# Altium project Charging_PCB.PrjPcb (part 1 of 2)
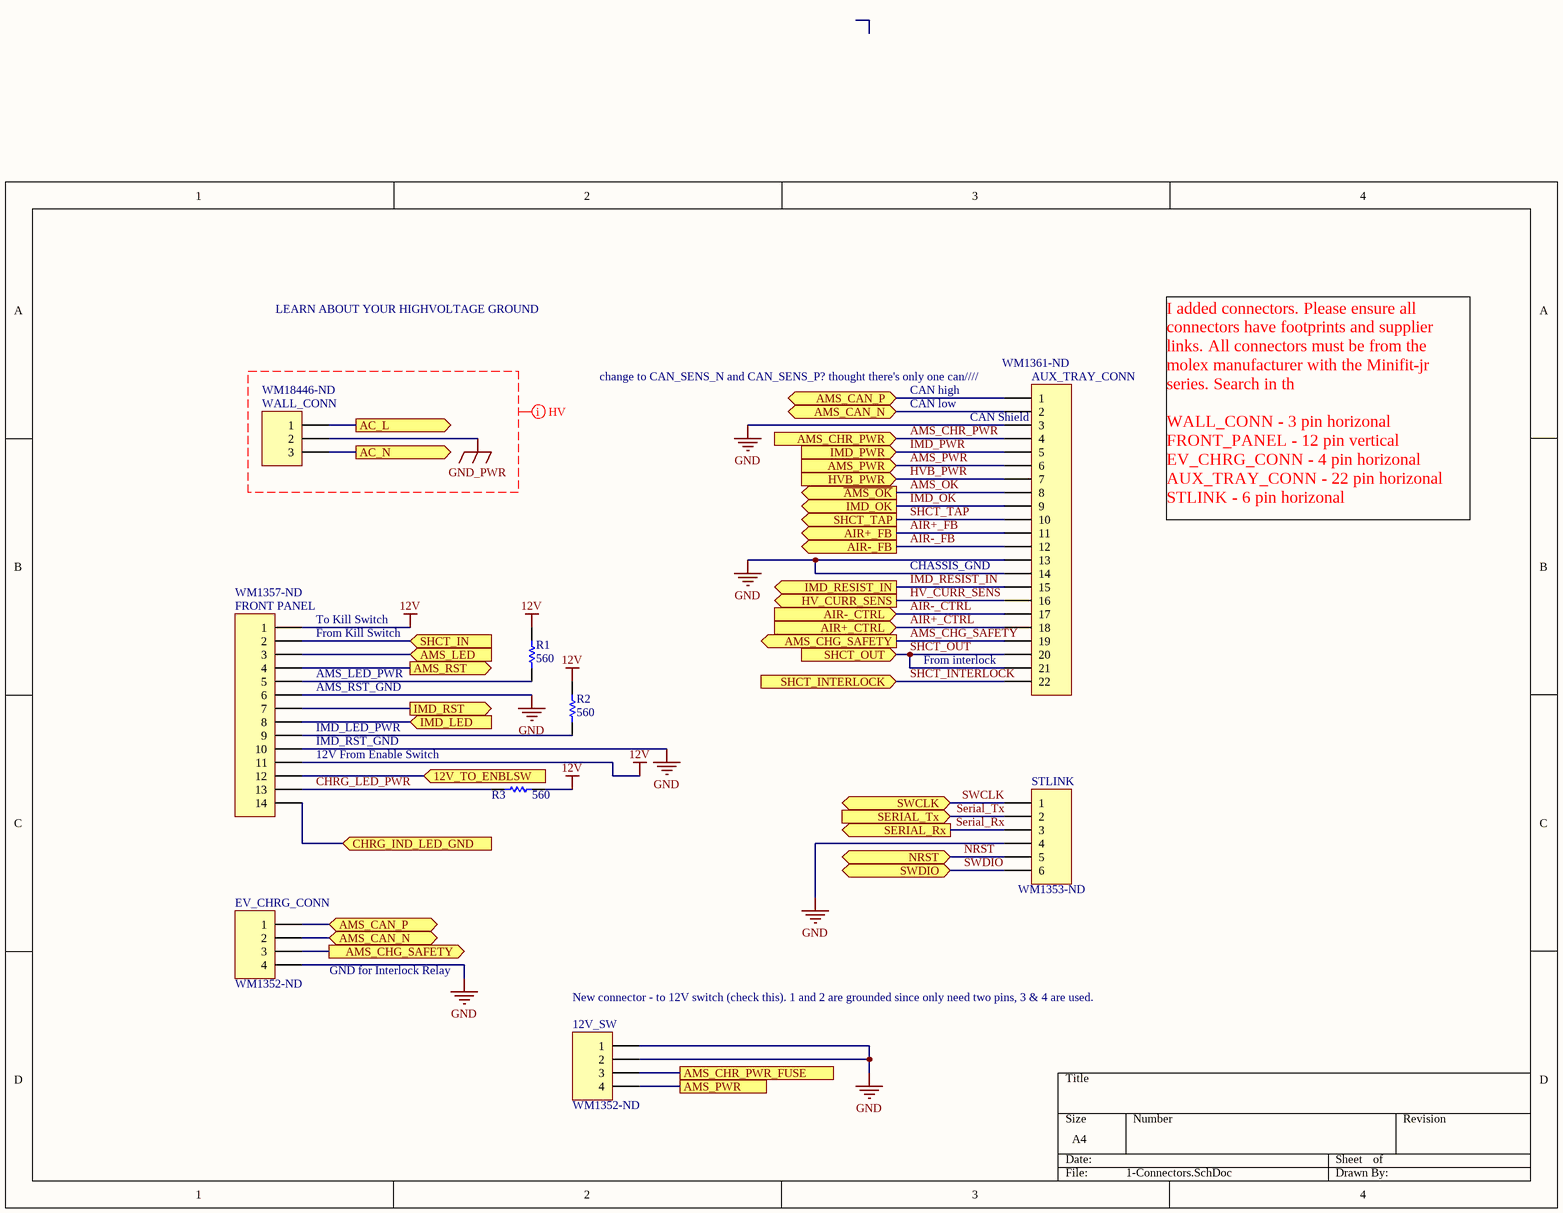
[diagram p0: 1-Connectors.SchDoc]
11 sheets, 147 parts. Net scope: global (net labels, ports and power ports of the same name join across sheets).
Board file: ePBR22_ACC_Charging.PcbDoc
Sheets:
  1-Connectors.SchDoc
  2-FET Control.SchDoc
  3-Fuses.SchDoc
  4-Power.SchDoc
  5-Latching Delay.SchDoc
  6-Latching AMS.SchDoc
  7-Latching IMD.SchDoc
  8-Controller.SchDoc
  9-Protections 1 of 2.SchDoc
  10-Protections 2 of 2.SchDoc
  12-Charging LED Indicator.SchDoc

## Sheet 1-Connectors.SchDoc
size A4

### Parts
12V_SW  Header 4  [WM1352-ND]  (value not drawn)
AUX_TRAY_CONN  (no value)  [WM1361-ND]
EV_CHRG_CONN  Header 4  [WM1352-ND]  (value not drawn)
FRONT_PANEL  (no value)  [WM1357-ND]
R1  560  [RESC0603(1608)_L]
R2  560  [RESC0603(1608)_L]
R3  560  [RESC0603(1608)_L]
STLINK  Header 6  [WM1353-ND]  (value not drawn)
WALL_CONN  Header 3  [WM18446-ND]  (value not drawn)

### Ports
12V_TO_ENBLSW (in), AC_L (out), AC_N (out), AIR+_CTRL (in), AIR+_FB (out), AIR-_CTRL (in), AIR-_FB (out), AMS_CAN_N (bidir), AMS_CAN_P (bidir), AMS_CHG_SAFETY (out), AMS_CHR_PWR (in), AMS_CHR_PWR_FUSE, AMS_LED (in), AMS_PWR, AMS_PWR (in), AMS_RST (out), CHRG_IND_LED_GND (in), HV_CURR_SENS (out), HVB_PWR (in), IMD_LED (in), IMD_OK (out), IMD_PWR (in), IMD_RESIST_IN (out), IMD_RST (out), NRST (bidir), SERIAL_Rx (out), SERIAL_Tx (in), SHCT_IN (in), SHCT_INTERLOCK (in), SHCT_OUT (in), SHCT_TAP (out), SWCLK (bidir), SWDIO (bidir), ~{AMS_OK} (out)

### Nets
12V: FRONT_PANEL.1 FRONT_PANEL.11 R1.2 R2.2 R3.1
GND: 12V_SW.1 12V_SW.2 AUX_TRAY_CONN.3 AUX_TRAY_CONN.13 AUX_TRAY_CONN.14 EV_CHRG_CONN.4 FRONT_PANEL.6 FRONT_PANEL.10 STLINK.4
GND_PWR: WALL_CONN.2
12V_TO_ENBLSW: FRONT_PANEL.12 ; port 12V_TO_ENBLSW
~{AMS_OK}: AUX_TRAY_CONN.8 ; port ~{AMS_OK}
AIR+_CTRL: AUX_TRAY_CONN.18 ; port AIR+_CTRL
AIR+_FB: AUX_TRAY_CONN.11 ; port AIR+_FB
AIR-_CTRL: AUX_TRAY_CONN.17 ; port AIR-_CTRL
AIR-_FB: AUX_TRAY_CONN.12 ; port AIR-_FB
AMS_CHG_SAFETY: AUX_TRAY_CONN.19 EV_CHRG_CONN.3 ; port AMS_CHG_SAFETY
AMS_CHR_PWR: AUX_TRAY_CONN.4 ; port AMS_CHR_PWR
AMS_CHR_PWR_FUSE: 12V_SW.3 ; port AMS_CHR_PWR_FUSE
AMS_LED: FRONT_PANEL.3 ; port AMS_LED
AMS_PWR: 12V_SW.4 AUX_TRAY_CONN.6 ; port AMS_PWR
AMS_RST: FRONT_PANEL.4 ; port AMS_RST
CHRG_LED_PWR: FRONT_PANEL.13 R3.2
HV_CURR_SENS: AUX_TRAY_CONN.16 ; port HV_CURR_SENS
HVB_PWR: AUX_TRAY_CONN.7 ; port HVB_PWR
IMD_LED: FRONT_PANEL.8 ; port IMD_LED
IMD_OK: AUX_TRAY_CONN.9 ; port IMD_OK
IMD_PWR: AUX_TRAY_CONN.5 ; port IMD_PWR
IMD_RESIST_IN: AUX_TRAY_CONN.15 ; port IMD_RESIST_IN
IMD_RST: FRONT_PANEL.7 ; port IMD_RST
NRST: STLINK.5 ; port NRST
Serial_Rx: STLINK.3 ; port SERIAL_Rx
Serial_Tx: STLINK.2 ; port SERIAL_Tx
SHCT_IN: FRONT_PANEL.2 ; port SHCT_IN
SHCT_INTERLOCK: AUX_TRAY_CONN.22 ; port SHCT_INTERLOCK
SHCT_OUT: AUX_TRAY_CONN.20 AUX_TRAY_CONN.21 ; port SHCT_OUT
SHCT_TAP: AUX_TRAY_CONN.10 ; port SHCT_TAP
SWCLK: STLINK.1 ; port SWCLK
SWDIO: STLINK.6 ; port SWDIO
NetAUX_TRAY_CONN_1: AUX_TRAY_CONN.1 EV_CHRG_CONN.1 ; port AMS_CAN_P
NetAUX_TRAY_CONN_2: AUX_TRAY_CONN.2 EV_CHRG_CONN.2 ; port AMS_CAN_N
NetFRONT_PANEL_5: FRONT_PANEL.5 R1.1
NetFRONT_PANEL_9: FRONT_PANEL.9 R2.1
NetFRONT_PANEL_14: FRONT_PANEL.14 ; port CHRG_IND_LED_GND
NetU2_1: WALL_CONN.1 ; port AC_L
NetU2_2: WALL_CONN.3 ; port AC_N

### Layout directives
mark named HV: GND_PWR

### Notes on the sheet
- LEARN ABOUT YOUR HIGHVOLTAGE GROUND
- (near AUX_TRAY_CONN) change to CAN_SENS_N and CAN_SENS_P? thought there's only one can////
- CAN high
- CAN low
- CAN Shield
- I added connectors. Please ensure all connectors have footprints and supplier links. All connectors must be from the molex manufacturer with the Minifit-jr series. Search in th
  WALL_CONN - 3 pin horizonal
  FRONT_PANEL - 12 pin vertical
  EV_CHRG_CONN - 4 pin horizonal
  AUX_TRAY_CONN - 22 pin horizonal
  STLINK - 6 pin horizonal
- (near FRONT_PANEL) To Kill Switch
- CHASSIS_GND
- (near FRONT_PANEL) From Kill Switch
- (near FRONT_PANEL) AMS_LED_PWR
- (near FRONT_PANEL) AMS_RST_GND
- (near AUX_TRAY_CONN) From interlock
- (near FRONT_PANEL) IMD_LED_PWR
- (near FRONT_PANEL) IMD_RST_GND
- 12V From Enable Switch
- GND for Interlock Relay
- (near 12V_SW) New connector - to 12V switch (check this). 1 and 2 are grounded since only need two pins, 3 & 4 are used.

### Library data of the parts
12V_SW EV_CHRG_CONN = Header 4: Header, 4-Pin; LatestRevisionDate: 17-Jul-2002; LatestRevisionNote: Re-released for DXP Platform.; Publisher: Altium Limited; Supplier 1: Digi-Key; Supplier Part Number 1: WM1352-ND
AUX_TRAY_CONN = Header 22: Header, 22-Pin; LatestRevisionDate: 17-Jul-2002; LatestRevisionNote: Re-released for DXP Platform.; Publisher: Altium Limited; Supplier 1: Digi-Key; Supplier Part Number 1: WM1361-ND
FRONT_PANEL = Header 14: Header, 14-Pin; LatestRevisionDate: 17-Jul-2002; LatestRevisionNote: Re-released for DXP Platform.; Publisher: Altium Limited; Supplier 1: Digi-Key; Supplier Part Number 1: WM1357-ND
R1-R3 = CMP-1591-00001-1: 0603 (1608 Metric) Chip Resistor; Case-Metric: 1608; Case-EIA: 0603; PackageReference: RESC0603(1608); Supplier 1: Digi-Key; Supplier Part Number 1: P560BZCT-ND
STLINK = Header 6: Header, 6-Pin; LatestRevisionDate: 17-Jul-2002; LatestRevisionNote: Re-released for DXP Platform.; Publisher: Altium Limited; Supplier 1: Digi-Key; Supplier Part Number 1: WM1353-ND
WALL_CONN = Header 3: Header, 3-Pin; LatestRevisionDate: 17-Jul-2002; LatestRevisionNote: Re-released for DXP Platform.; Publisher: Altium Limited; Supplier 1: Digi-Key; Supplier Part Number 1: WM18446-ND

## Sheet 2-FET Control.SchDoc
size A
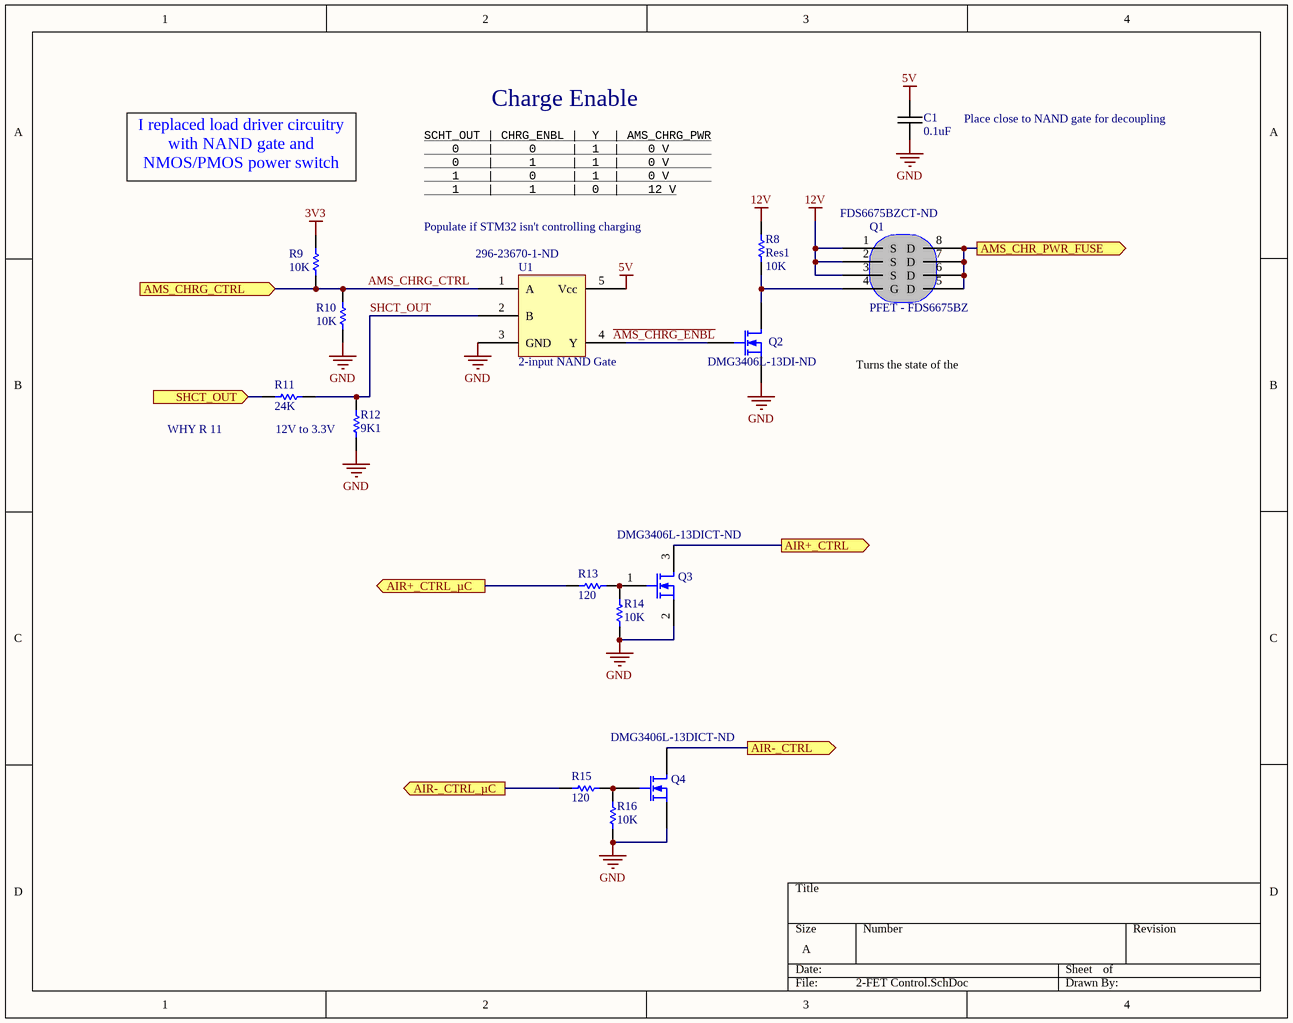
[diagram p1: 2-FET Control.SchDoc]

### Parts
C1  value 0.1uF  [1608[0603]]  (hidden comment: 100nF)
Q1  PFET - FDS6675BZ  Supplier Part Number 1: FDS6675BZCT-ND  [SOIC127P600X175-8N]
Q2  Supplier Part Number 1: DMG3406L-13DI-ND  [SOT-23_N]
Q3  Supplier Part Number 1: DMG3406L-13DICT-ND  [SOT-23_N]
Q4  Supplier Part Number 1: DMG3406L-13DICT-ND  [SOT-23_N]
R8  Res1  value 10K  [1608[0603]]
R9  10K  [RESC0603(1608)_L]
R10  10K  [RESC0603(1608)_L]
R11  24K  [RESC0603(1608)_N]
R12  9K1  [RESC0603(1608)_M]
R13  120  [1608[0603]]
R14  10K  [1608[0603]]
R15  120  [1608[0603]]
R16  10K  [1608[0603]]
U1  2-input NAND Gate  Supplier Part Number 1: 296-23670-1-ND  [SOT23-6_M]

### Ports
AIR+_CTRL (out), AIR+_CTRL_µC (out), AIR-_CTRL (out), AIR-_CTRL_µC (out), AMS_CHR_PWR_FUSE (out), AMS_CHRG_CTRL (in), SHCT_OUT (in)

### Nets
3V3: R9.2
5V: C1.1 U1.5(Vcc)
12V: Q1.1(S) Q1.2(S) Q1.3(S) R8.2
GND: C1.2 Q2.2(S) Q3.2(S) Q4.2(S) R10.1 R12.1 R14.1 R16.1 U1.3(GND)
AIR+_CTRL: Q3.3(D) ; port AIR+_CTRL
AIR-_CTRL: Q4.3(D) ; port AIR-_CTRL
AMS_CHR_PWR_FUSE: Q1.5(D) Q1.6(D) Q1.7(D) Q1.8(D) ; port AMS_CHR_PWR_FUSE
AMS_CHRG_CTRL: R9.1 R10.2 U1.1(A) ; port AMS_CHRG_CTRL
SHCT_OUT: R11.1 R11.2 R12.2 U1.2(B) ; port SHCT_OUT
NetQ1_4: Q1.4(G) Q2.3(D) R8.1
NetQ2_1: Q2.1(G) U1.4(Y)
NetQ3_1: Q3.1(G) R13.2 R14.2
NetQ4_1: Q4.1(G) R15.2 R16.2
NetR13_1: R13.1 ; port AIR+_CTRL_µC
NetR15_1: R15.1 ; port AIR-_CTRL_µC

### Notes on the sheet
- Charge Enable
- Place close to NAND gate for decoupling
- I replaced load driver circuitry with NAND gate and NMOS/PMOS power switch
- (near R8) SCHT_OUT | CHRG_ENBL |  Y  | AMS_CHRG_PWR
  0    |     0     |  1  |    0 V
  0    |     1     |  1  |    0 V
  1    |     0     |  1  |    0 V
  1    |     1     |  0  |    12 V
- Populate if STM32 isn't controlling charging
- WHY R 11
- (near R12) 12V to 3.3V
- Turns the state of the
- Labels drawn without touching a wire or pin: ~{AMS_CHRG_ENBL}

### Library data of the parts
C1 = 0805C-100nF-25V-X7R-MUR: CAP CER 0.1UF 50V X7R 0603; Manufacturer: Kemet; Manufacturer Part Number: C0603C104K5RACAUTO; Capacitance: 0.1µF; Tolerance: ±10%; Supplier 1: Digi-Key; Supplier Part Number 1: 399-6856-1-ND; RoHS: RoHS Compliant; Category: Capacitors; Stock 1: 157876; Pricing 1: 1=0.14, 10=0.095, 25=0.0672, 50=0.0514, 100=0.0435, 250=0.03556, 1000=0.02324 (CAD); Packaging: Cut Tape (CT); Voltage - Rated: 50V; Temperature Coefficient: X7R; Mounting Type: Surface Mount, MLCC; Operating Temperature: -55°C ~ 125°C; Applications: Automotive; Ratings: AEC-Q200; Package / Case: 0603 (1608 Metric); Size / Dimension: 0.063" L x 0.031" W (1.60mm x 0.80mm); Height - Seated (Max): -; Thickness (Max): 0.034" (0.87mm); Lead Spacing: -; Features: -; Lead Style: -; ComponentLink1URL: http://capacitoredge.kemet.com/capedge2/DataSheet?pn=C0603C104K5RACAUTO; ComponentLink1Description: http://capacitoredge.kemet.com/capedge2/DataSheet?pn=C0603C104K5RACAUTO
Q1 = MOSFET: MOSFET P-CH 8-SOIC; Manufacturer: Fairchild/ON Semiconductor; FET Type: P-Channel; Drain to Source Voltage (Vdss): 30V; Current - Continuous Drain (Id) @ 25°C: 11A (Ta); Drive Voltage (Max Rds On,  Min Rds On): 4.5V, 10V; Vgs(th) (Max) @ Id: 3V @ 250µA; Gate Charge (Qg) (Max) @ Vgs: 62nC @ 10V; Input Capacitance (Ciss) (Max) @ Vds: 2470pF @ 15V; Vgs (Max): ±25V; Power Dissipation (Max): 2.5W (Ta); Rds On (Max) @ Id, Vgs: 13 mOhm @ 11A, 10V; Manufacturer Part Number: FDS6675BZ; RoHS: RoHS Compliant; Category: Discrete Semiconductor Products; Stock 1: 7940; Pricing 1: 1=1.29, 10=1.156, 100=0.9013, 500=0.74452, 1000=0.58778 (CAD); Packaging: Cut Tape (CT); Part Status: Active; Technology: MOSFET (Metal Oxide); FET Feature: -; Operating Temperature: -55°C ~ 150°C (TJ); Mounting Type: Surface Mount; Supplier Device Package: 8-SO; Package / Case: 8-SOIC (0.154", 3.90mm Width); ComponentLink1URL: https://www.fairchildsemi.com/datasheets/FD/FDS6675BZ.pdf; ComponentLink1Description: https://www.fairchildsemi.com/datasheets/FD/FDS6675BZ.pdf; Supplier 1: Digi-Key
Q2-Q4 = MOSFET-N: N-Channel MOSFET; Manufacturer: Infineon Technologies; Manufacturer Part Number: IPD075N03L G; FET Type: MOSFET N-Channel, Metal Oxide; FET Feature: Logic Level Gate; Drain to Source Voltage (Vdss): 30V; Current - Continuous Drain (Id) @ 25°C: 50A (Tc); Rds On (Max) @ Id, Vgs: 7.5 mOhm @ 30A, 10V; Vgs(th) (Max) @ Id: 2.2V @ 250µA; Gate Charge (Qg) @ Vgs: 18nC @ 10V; Input Capacitance (Ciss) @ Vds: 1900pF @ 15V; Power - Max: 47W; Published: 8-Jun-2000; LatestRevisionDate: 17-Jul-2002; LatestRevisionNote: Re-released for DXP Platform.; PackageVersion: 1995/1996; PackageReference: E3; Publisher: Altium Limited; PackageDescription: TO, Flat Index; 3 In-Line, Axial Leads; Body Dia. 4.6mm; Lead Dia. 0.5 mm (max); RoHS: RoHS Compliant; Category: Discrete Semiconductor Products; Packaging: Cut Tape (CT); Mounting Type: Surface Mount; Package / Case: TO-252-3, DPak (2 Leads + Tab), SC-63; Supplier Device Package: PG-TO252-3; ComponentLink1URL: http://www.infineon.com/dgdl/Infineon-IPD075N03LG-DS-v02_01-en.pdf?folderId=5546d4694909da4801490a07012f053b&fileId=db3a30431936bc4b011951d824f83aeb; ComponentLink1Description: http://www.infineon.com/dgdl/Infineon-IPD075N03LG-DS-v02_01-en.pdf?folderId=5546d4694909da4801490a07012f053b&fileId=db3a30431936bc4b011951d824f83aeb; ComponentLink2URL: http://www.semicon.toshiba.co.jp/info/docget.jsp?type=datasheet&lang=en&pid=SSM3K329R; ComponentLink2Description: http://www.semicon.toshiba.co.jp/info/docget.jsp?type=datasheet&lang=en&pid=SSM3K329R; Supplier 1: Digi-Key
R8 = Res1: RES SMD 10K OHM 5% 1/4W 0603; Manufacturer: Rohm Semiconductor; Manufacturer Part Number: ESR03EZPJ103; Power (Watts): 0.25W, 1/4W; Temperature Coefficient: ±200ppm/°C; Published: 8-Jun-2000; LatestRevisionDate: 17-Jul-2002; LatestRevisionNote: Re-released for DXP Platform.; PackageReference: AXIAL-0.3; Publisher: Altium Limited; PackageDescription: Axial Device, Thru-Hole; 2 Leads; 0.3 in Pin Spacing; Supplier 1: Digi-Key; Supplier Part Number 1: RHM10KDCT-ND; RoHS: RoHS Compliant; Category: Resistors; Stock 1: 0; Pricing 1: 1=0.15, 10=0.119, 25=0.0824, 50=0.0642, 100=0.0458, 250=0.03568, 500=0.02836, 1000=0.02012 (CAD); Packaging: Cut Tape (CT); Part Status: Active; Resistance (Ohms): 10k; Tolerance: ±5%; Composition: Thick Film; Features: Automotive AEC-Q200, Pulse Withstanding; Operating Temperature: -55°C ~ 155°C; Package / Case: 0603 (1608 Metric); Supplier Device Package: 0603; Size / Dimension: 0.063" L x 0.031" W (1.60mm x 0.80mm); Height - Seated (Max): 0.022" (0.55mm); Failure Rate: -; ComponentLink1URL: http://rohmfs.rohm.com/en/products/databook/datasheet/passive/resistor/chip_resistor/esr.pdf; ComponentLink1Description: http://rohmfs.rohm.com/en/products/databook/datasheet/passive/resistor/chip_resistor/esr.pdf
R9 R10 = CMP-1591-00001-1: as R1 on sheet 1-Connectors; PackageReference: RESC0603(1608); Supplier 1: Digi-Key; Supplier Part Number 1: 311-10KGRCT-ND
R11 = CMP-1012-00107-1: 24K 0.1W 5% 0603 (1608 Metric)  SMD; Case-Metric: 1608; Case-EIA: 0603; Value: 24000.00 Ohm; Tolerance: 5 %; Technology: SMT; Power: 0.1 W
R12 = CMP-1012-00097-1: 9K1 0.1W 5% 0603 (1608 Metric)  SMD; Case-EIA: 0603; Value: 9100.00 Ohm; Case-Metric: 1608; Technology: SMT; Power: 0.1 W; Tolerance: 5 %
R13 R15 = Res1: Resistor; Manufacturer: Panasonic Electronic Components; Manufacturer Part Number: ERJ-3EKF60R4V; Resistance (Ohms): 60.4; Tolerance: ±1%; Power (Watts): 0.1W, 1/10W; Temperature Coefficient: ±100ppm/°C; Published: 8-Jun-2000; LatestRevisionDate: 17-Jul-2002; LatestRevisionNote: Re-released for DXP Platform.; PackageReference: AXIAL-0.3; Publisher: Altium Limited; PackageDescription: Axial Device, Thru-Hole; 2 Leads; 0.3 in Pin Spacing; Value: 120; Supplier 1: Digi-Key; Supplier Part Number 1: P60.4HCT-ND; RoHS: RoHS Compliant; Category: Resistors; Stock 1: 113077; Pricing 1: 1=0.15, 50=0.0176, 100=0.0129, 250=0.00992, 500=0.0079, 1000=0.00583 (CAD); Packaging: Cut Tape (CT); Composition: Thick Film; Features: Automotive AEC-Q200; Operating Temperature: -55°C ~ 155°C; Package / Case: 0603 (1608 Metric); Supplier Device Package: 0603; Size / Dimension: 0.063" L x 0.031" W (1.60mm x 0.80mm); Height: 0.022" (0.55mm); Number of Terminations: 2; ComponentLink1URL: http://industrial.panasonic.com/www-cgi/jvcr13pz.cgi?E+PZ+3+AOA0002+ERJ3EKF60R4V+7+WW; ComponentLink1Description: http://industrial.panasonic.com/www-cgi/jvcr13pz.cgi?E+PZ+3+AOA0002+ERJ3EKF60R4V+7+WW
R14 R16 = Res1: Resistor; Manufacturer: Rohm Semiconductor; Manufacturer Part Number: ESR03EZPJ103; Tolerance: ±5%; Power (Watts): 0.25W, 1/4W; Temperature Coefficient: ±200ppm/°C; Published: 8-Jun-2000; LatestRevisionDate: 17-Jul-2002; LatestRevisionNote: Re-released for DXP Platform.; PackageReference: AXIAL-0.3; Publisher: Altium Limited; PackageDescription: Axial Device, Thru-Hole; 2 Leads; 0.3 in Pin Spacing; Value: 10K; Supplier 1: Digi-Key; Supplier Part Number 1: RHM10KDCT-ND; RoHS: RoHS Compliant; Category: Resistors; Stock 1: 8360; Pricing 1: 1=0.15, 10=0.121, 25=0.0836, 100=0.0466, 250=0.03628, 500=0.02884, 1000=0.02046 (CAD); Packaging: Cut Tape (CT); Resistance (Ohms): 10k; Composition: Thick Film; Features: Automotive AEC-Q200, Pulse Withstanding; Operating Temperature: -55°C ~ 155°C; Package / Case: 0603 (1608 Metric); Supplier Device Package: 0603 (1608 Metric); Size / Dimension: 0.063" L x 0.031" W (1.60mm x 0.80mm); Height: 0.022" (0.55mm); Number of Terminations: 2; ComponentLink1URL: http://rohmfs.rohm.com/en/products/databook/datasheet/passive/resistor/chip_resistor/esr.pdf; ComponentLink1Description: http://rohmfs.rohm.com/en/products/databook/datasheet/passive/resistor/chip_resistor/esr.pdf
U1 = NC7SZ08: IC GATE NAND 1CH 2-INP SC-70-5; Manufacturer: Texas Instruments; Manufacturer Part Number: SN74AHC1G00QDCKRQ1; Number of Circuits: 1; Number of Inputs: 2; Voltage - Supply: 2 V ~ 5.5 V; Current - Quiescent (Max): 1µA; Current - Output High, Low: 8mA, 8mA; Logic Level - Low: 0.5 V ~ 1.65 V; Logic Level - High: 1.5 V ~ 3.85 V; Max Propagation Delay @ V, Max CL: 7.5ns @ 5V, 50pF; RoHS: RoHS Compliant; Category: Integrated Circuits (ICs); Stock 1: 7211; Pricing 1: 1=0.69, 10=0.524, 100=0.3262, 500=0.22294, 1000=0.17137 (CAD); Packaging: Cut Tape (CT); Logic Type: NAND Gate; Features: Schmitt Trigger; Operating Temperature: -40°C ~ 125°C; Mounting Type: Surface Mount; Supplier Device Package: SC-70-5; Package / Case: 5-TSSOP, SC-70-5, SOT-353; ComponentLink1URL: http://www.ti.com/lit/ds/symlink/sn74ahc1g00-q1.pdf; ComponentLink1Description: http://www.ti.com/lit/ds/symlink/sn74ahc1g00-q1.pdf; Supplier 1: Digi-Key

## Sheet 3-Fuses.SchDoc
size A4
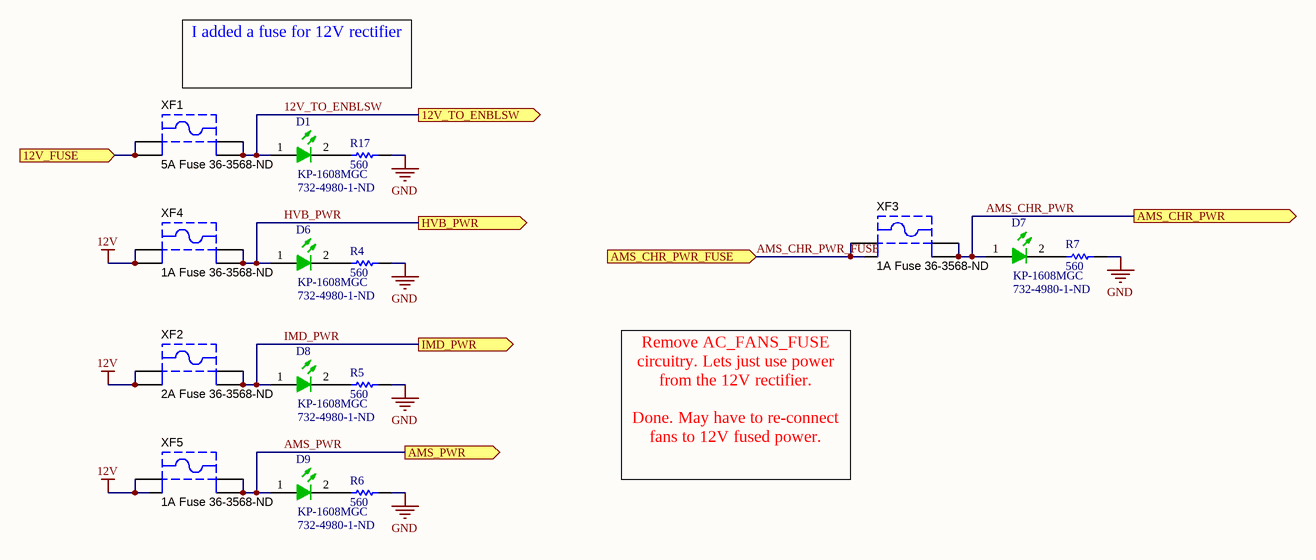
[diagram p2: 3-Fuses.SchDoc]

### Parts
D1  KP-1608MGC  Supplier Part Number 1: 732-4980-1-ND  [KING-0603LED_GREEN_V]
D6  KP-1608MGC  Supplier Part Number 1: 732-4980-1-ND  [KING-0603LED_GREEN_V]
D7  KP-1608MGC  Supplier Part Number 1: 732-4980-1-ND  [KING-0603LED_GREEN_V]
D8  KP-1608MGC  Supplier Part Number 1: 732-4980-1-ND  [KING-0603LED_GREEN_V]
D9  KP-1608MGC  Supplier Part Number 1: 732-4980-1-ND  [KING-0603LED_GREEN_V]
R4  560  [RESC0603(1608)_L]
R5  560  [RESC0603(1608)_L]
R6  560  [RESC0603(1608)_L]
R7  560  [RESC0603(1608)_L]
R17  560  [RESC0603(1608)_L]
XF1  5A Fuse 36-3568-ND  [KSTN-3568_V]
XF2  2A Fuse 36-3568-ND  [KSTN-3568_V]
XF3  1A Fuse 36-3568-ND  [KSTN-3568_V]
XF4  1A Fuse 36-3568-ND  [KSTN-3568_V]
XF5  1A Fuse 36-3568-ND  [KSTN-3568_V]

### Ports
12V_FUSE (in), 12V_TO_ENBLSW (out), AMS_CHR_PWR (out), AMS_CHR_PWR_FUSE (in), AMS_PWR (out), HVB_PWR (out), IMD_PWR (out)

### Nets
12V: XF2.1 XF2.2 XF4.1 XF4.2 XF5.1 XF5.2
GND: R4.2 R5.2 R6.2 R7.2 R17.2
12V_TO_ENBLSW: D1.1(A) XF1.3 XF1.4 ; port 12V_TO_ENBLSW
AMS_CHR_PWR: D7.1(A) XF3.3 XF3.4 ; port AMS_CHR_PWR
AMS_CHR_PWR_FUSE: XF3.1 XF3.2 ; port AMS_CHR_PWR_FUSE
AMS_PWR: D9.1(A) XF5.3 XF5.4 ; port AMS_PWR
HVB_PWR: D6.1(A) XF4.3 XF4.4 ; port HVB_PWR
IMD_PWR: D8.1(A) XF2.3 XF2.4 ; port IMD_PWR
NetD1_2: D1.2(K) R17.1
NetD6_2: D6.2(K) R4.1
NetD7_2: D7.2(K) R7.1
NetD8_2: D8.2(K) R5.1
NetD9_2: D9.2(K) R6.1
NetU2_4: XF1.1 XF1.2 ; port 12V_FUSE

### Notes on the sheet
- I added a fuse for 12V rectifier
- Remove AC_FANS_FUSE circuitry. Lets just use power from the 12V rectifier.
  Done. May have to re-connect fans to 12V fused power.

### Library data of the parts
D1 D6-D9 = CMP-0404-00001-1: LED, SMT, 0603(1608), 1.1mm thickness, Green; Manufacturer: Kingbright; Reverse Voltage: 5 V; Power Dissipation: 75 mW; Forward Current: 30 mA; Packing Type: 2000 pcs / reel; Mounting Technology: Surface Mount; Storage Temperature: -40 to +85 degC; ComponentLink1URL: http://www.kingbright.com/; PackageDescription: 2-Pin SMT LED, 1.6 x 0.8 mm Pitch; PartNumber: KP-1608MGC; PackageReference: 0603LED_GREEN; ComponentLink1Description: Manufacturer URL; Supplier 1: Digi-Key
R4-R7 R17 = CMP-1591-00001-1: as R1 on sheet 1-Connectors; PackageReference: RESC0603(1608); Supplier 1: Digi-Key; Supplier Part Number 1: P560BZCT-ND
XF1-XF5 = CMP-2000-05464-1: Fuse Holder, 20 A, 500 V, -50 to 145 degC, 4-Pin THD, RoHS; Manufacturer: Keystone; Package Reference: 3568; Datasheet Version: 04/2013; Datasheet URL: https://datasheet.ciiva.com/16294/m60-2p40-16294706.pdf; Manufacturer URL: http://www.keyelco.com/; Mounting Technology: ThroughHole; Package Description: 4-Pin Through Hole Device, Body 16 x 6.73 mm, Pitch 9.9 mm

## Sheet 4-Power.SchDoc
size A
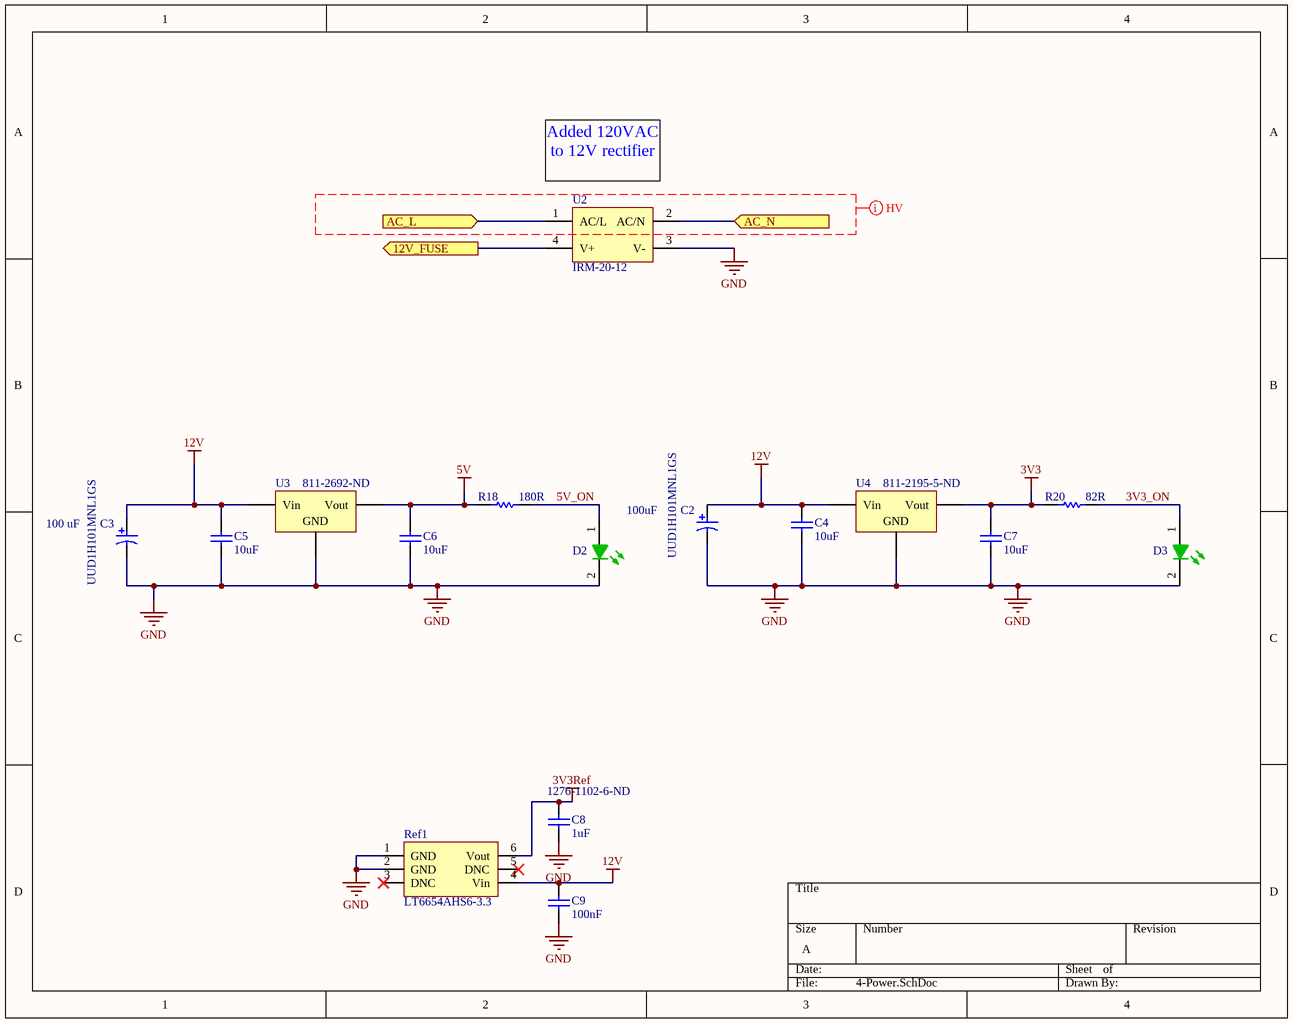
[diagram p3: 4-Power.SchDoc]

### Parts
C2  UUD1H101MNL1GS  [NIC-CAPA2-8X10_V]
C3  UUD1H101MNL1GS  Rated Capacitance: 100 uF  [NIC-CAPA2-8X10_V]
C4  value 10uF  [C1210_M]  (hidden comment: Cap)
C5  value 10uF  [C1210_M]  (hidden comment: Cap)
C6  value 10uF  [C1210_M]  (hidden comment: Cap)
C7  value 10uF  [C1210_M]  (hidden comment: Cap)
C8  value 1uF  Supplier Part Number 1: 1276-1102-6-ND  [1608[0603]]  (hidden comment: Cap)
C9  value 100nF  [1608[0603]]  (hidden comment: Cap)
D2  KP-1608MGC  [KING-0603LED_GREEN_V]  (value not drawn)
D3  KP-1608MGC  [KING-0603LED_GREEN_V]  (value not drawn)
R18  value 180R  [1608[0603]]  (hidden comment: Res1)
R20  value 82R  [1608[0603]]  (hidden comment: Res1)
Ref1  LT6654AHS6-3.3  [TSOT-23]
U2  IRM-20-12  [MEANW-IRM-20-12]
U3  Supplier Part Number 1: 811-2692-ND  [DCDC_HORIZONTAL]  (hidden comment: Volt Reg)
U4  Supplier Part Number 1: 811-2195-5-ND  [DCDC_VERTICAL]  (hidden comment: Volt Reg)

### Ports
12V_FUSE (out), AC_L (in), AC_N (in)

### Nets
3V3: C7.2 R20.1 U4.3(Vout)
3V3Ref: C8.2 Ref1.6(Vout)
5V: C6.2 R18.1 U3.3(Vout)
12V: C2.1 C3.1 C4.2 C5.2 C9.2 Ref1.4(Vin) U3.1(Vin) U4.1(Vin)
GND: C2.2 C3.2 C4.1 C5.1 C6.1 C7.1 C8.1 C9.1 D2.2(K) D3.2(K) Ref1.1(GND) Ref1.2(GND) U2.3(V-) U3.2(GND) U4.2(GND)
3V3_ON: D3.1(A) R20.2
5V_ON: D2.1(A) R18.2
NetU2_1: U2.1(AC/L) ; port AC_L
NetU2_2: U2.2(AC/N) ; port AC_N
NetU2_4: U2.4(V+) ; port 12V_FUSE

Not connected (* = marked no-connect by the designer): Ref1 3(DNC)* 5(DNC)*

### Layout directives
mark named HV: (no net found under the mark)

### Notes on the sheet
- (near U2) Added 120VAC to 12V rectifier
- 100uF

### Library data of the parts
C2 = CMP-0687-00073-1: Aluminum Electrolytic Capacitor, UD Series, Low Impedance, 100 uF, 50 V, + / - 20%, -55 to 105 degC, Chip Type, 8 x 10 mm D x L, Pb-Free, Reel; Manufacturer: Nichicon; Rated Ripple Current (at 100kHz): 300 mA; Tolerance Rated Capacitance: -20 to 20%; Packing: Dia382mm Reel; Impedance: 0.34 Ohm; Rated Voltage: 50 V; Endurance Time: 5000 h; Rated Capacitance: 100 uF; Capacitance: 100µF; Voltage Rating: 50V; Lifetime @ Temp.: 5000 Hrs @ 105°C; Polarization: Polar; Ripple Current: 300mA; Surface Mount Land Size: 0.327" L x 0.327" W (8.30mm x 8.30mm); ComponentLink3Description: Package Specification; ComponentLink2Description: Datasheet; PackageReference: CAPAE-D8H10; RoHS: TRUE; Length: 10 mm; Mounting Technology: Surface Mount; PackageDescription: 2-Pin Surface Mount Device, Diameter 8 mm, Height 10 mm, Pitch 6.5 mm; DatasheetVersion: 08/2012; Diameter: 8 mm; ComponentLink3URL: http://products.nichicon.co.jp/en/pdf/XJA043/e-ud.pdf; ComponentLink1Description: Manufacturer URL; PartNumber: UUD1H101MNL1GS; ComponentLink2URL: http://products.nichicon.co.jp/en/pdf/XJA043/e-ud.pdf; ComponentLink1URL: http://www.nichicon.co.jp/; Supplier 1: Digi-Key; Supplier Part Number 1: 493-2306-1-ND; Manufacturer Part Number: UUD1H101MNL1GS; Category: Capacitors; Stock 1: 65948; Pricing 1: 1=0.92, 10=0.685, 25=0.5868, 50=0.5478, 100=0.4696, 250=0.43044 (CAD); Packaging: Cut Tape (CT); Part Status: Active; Tolerance: ±20%; ESR (Equivalent Series Resistance): -; Operating Temperature: -55°C ~ 105°C; Applications: General Purpose; Lead Spacing: -; Size / Dimension: 0.315" Dia (8.00mm); Height - Seated (Max): 0.394" (10.00mm); Mounting Type: Surface Mount; Package / Case: Radial, Can - SMD; ComponentLink4URL: http://nichicon-us.com/english/products/pdfs/e-uud.pdf; ComponentLink4Description: http://nichicon-us.com/english/products/pdfs/e-uud.pdf
C3 = CMP-0687-00073-1: Aluminum Electrolytic Capacitor, UD Series, Low Impedance, 100 uF, 50 V, + / - 20%, -55 to 105 degC, Chip Type, 8 x 10 mm D x L, Pb-Free, Reel; Manufacturer: Nichicon; Rated Ripple Current (at 100kHz): 300 mA; Tolerance Rated Capacitance: -20 to 20%; Packing: Dia382mm Reel; Impedance: 0.34 Ohm; Rated Voltage: 50 V; Endurance Time: 5000 h; Capacitance: 100µF; Voltage Rating: 50V; Lifetime @ Temp.: 5000 Hrs @ 105°C; Polarization: Polar; Ripple Current: 300mA; Surface Mount Land Size: 0.327" L x 0.327" W (8.30mm x 8.30mm); ComponentLink3Description: Package Specification; ComponentLink2Description: Datasheet; PackageReference: CAPAE-D8H10; RoHS: TRUE; Length: 10 mm; Mounting Technology: Surface Mount; PackageDescription: 2-Pin Surface Mount Device, Diameter 8 mm, Height 10 mm, Pitch 6.5 mm; DatasheetVersion: 08/2012; Diameter: 8 mm; ComponentLink3URL: http://products.nichicon.co.jp/en/pdf/XJA043/e-ud.pdf; ComponentLink1Description: Manufacturer URL; PartNumber: UUD1H101MNL1GS; ComponentLink2URL: http://products.nichicon.co.jp/en/pdf/XJA043/e-ud.pdf; ComponentLink1URL: http://www.nichicon.co.jp/; Supplier 1: Digi-Key; Supplier Part Number 1: 493-2306-1-ND; Manufacturer Part Number: UUD1H101MNL1GS; Category: Capacitors; Stock 1: 65948; Pricing 1: 1=0.92, 10=0.685, 25=0.5868, 50=0.5478, 100=0.4696, 250=0.43044 (CAD); Packaging: Cut Tape (CT); Part Status: Active; Tolerance: ±20%; ESR (Equivalent Series Resistance): -; Operating Temperature: -55°C ~ 105°C; Applications: General Purpose; Lead Spacing: -; Size / Dimension: 0.315" Dia (8.00mm); Height - Seated (Max): 0.394" (10.00mm); Mounting Type: Surface Mount; Package / Case: Radial, Can - SMD; ComponentLink4URL: http://nichicon-us.com/english/products/pdfs/e-uud.pdf; ComponentLink4Description: http://nichicon-us.com/english/products/pdfs/e-uud.pdf
C4-C7 = Cap: Capacitor; Manufacturer: Yageo; Manufacturer Part Number: CC1210ZKY5V8BB106; Capacitance: 10µF; Tolerance: -20%, +80%; Voltage - Rated: 25V; Temperature Coefficient: Y5V (F); Supplier 1: Digi-Key; Supplier Part Number 1: 311-2063-1-ND; RoHS: RoHS Compliant; Category: Capacitors; Stock 1: 1156; Pricing 1: 1=0.47, 10=0.323, 25=0.258, 50=0.2154, 100=0.1829, 250=0.14528, 500=0.12912, 1000=0.11298 (CAD); Packaging: Cut Tape (CT); Part Status: Active; Operating Temperature: -30°C ~ 85°C; Features: -; Ratings: -; Applications: General Purpose; Failure Rate: -; Mounting Type: Surface Mount, MLCC; Package / Case: 1210 (3225 Metric); Size / Dimension: 0.126" L x 0.098" W (3.20mm x 2.50mm); Height - Seated (Max): -; Thickness (Max): 0.083" (2.10mm); Lead Spacing: -; Lead Style: -; ComponentLink1URL: http://www.yageo.com/documents/recent/UPY-GPHC_Y5V_6.3V-to-50V_7.pdf; ComponentLink1Description: http://www.yageo.com/documents/recent/UPY-GPHC_Y5V_6.3V-to-50V_7.pdf
C8 = Cap: Capacitor; Manufacturer: Murata Electronics North America; Manufacturer Part Number: GRM188R61E105KA12D; Capacitance: 1µF; Tolerance: ±10%; Voltage - Rated: 25V; Temperature Coefficient: X5R; RoHS: RoHS Compliant; Category: Capacitors; Packaging: Cut Tape (CT); Part Status: Active; Operating Temperature: -55°C ~ 85°C; Features: -; Ratings: -; Applications: General Purpose; Mounting Type: Surface Mount, MLCC; Package / Case: 0603 (1608 Metric); Size / Dimension: 0.063" L x 0.031" W (1.60mm x 0.80mm); Height - Seated (Max): -; Thickness (Max): 0.035" (0.90mm); Lead Spacing: -; Lead Style: -; ComponentLink1URL: http://www.murata.com/~/media/webrenewal/support/library/catalog/products/capacitor/mlcc/c02e.pdf; ComponentLink1Description: http://www.murata.com/~/media/webrenewal/support/library/catalog/products/capacitor/mlcc/c02e.pdf; Supplier 1: Digi-Key
C9 = Cap: Capacitor; Manufacturer: Yageo; Manufacturer Part Number: CC0603KRX7R9BB104; Capacitance: 0.10µF; Tolerance: ±10%; Voltage - Rated: 50V; Temperature Coefficient: X7R; Supplier 1: Digi-Key; Supplier Part Number 1: 311-1344-1-ND; RoHS: RoHS Compliant; Category: Capacitors; Stock 1: 4016262; Pricing 1: 1=0.15, 10=0.043, 25=0.0312, 50=0.0232, 100=0.0189, 250=0.0158, 500=0.01346, 1000=0.01059 (CAD); Packaging: Cut Tape (CT); Part Status: Active; Operating Temperature: -55°C ~ 125°C; Features: -; Ratings: -; Applications: General Purpose; Failure Rate: -; Mounting Type: Surface Mount, MLCC; Package / Case: 0603 (1608 Metric); Size / Dimension: 0.063" L x 0.031" W (1.60mm x 0.80mm); Height - Seated (Max): -; Thickness (Max): 0.035" (0.90mm); Lead Spacing: -; Lead Style: -; ComponentLink1URL: http://www.yageo.com/documents/recent/UPY-GPHC_X7R_6.3V-to-50V_16.pdf; ComponentLink1Description: http://www.yageo.com/documents/recent/UPY-GPHC_X7R_6.3V-to-50V_16.pdf
D2 D3 = CMP-0404-00001-1: as D1 on sheet 3-Fuses; Mounting Technology: Surface Mount; Storage Temperature: -40 to +85 degC; ComponentLink1URL: http://www.kingbright.com/; PackageDescription: 2-Pin SMT LED, 1.6 x 0.8 mm Pitch; PartNumber: KP-1608MGC; PackageReference: 0603LED_GREEN; ComponentLink1Description: Manufacturer URL; Supplier 1: Digi-Key; Supplier Part Number 1: 732-4980-1-ND
R18 = Res1: Resistor; Manufacturer: Yageo; Manufacturer Part Number: RC0603JR-07180RL; Resistance (Ohms): 180; Tolerance: ±5%; Power (Watts): 0.1W, 1/10W; Temperature Coefficient: ±100ppm/°C; Supplier 1: Digi-Key; Supplier Part Number 1: 311-180GRCT-ND; RoHS: RoHS Compliant; Category: Resistors; Stock 1: 201936; Pricing 1: 1=0.16, 10=0.016, 25=0.0112, 50=0.0084, 100=0.0062, 250=0.0048, 500=0.00382, 1000=0.00281 (CAD); Packaging: Cut Tape (CT); Part Status: Active; Composition: Thick Film; Features: Moisture Resistant; Operating Temperature: -55°C ~ 155°C; Package / Case: 0603 (1608 Metric); Supplier Device Package: 0603; Size / Dimension: 0.063" L x 0.031" W (1.60mm x 0.80mm); Height - Seated (Max): 0.022" (0.55mm); Number of Terminations: 2; Failure Rate: -; ComponentLink1URL: http://www.yageo.com/NewPortal/yageodocoutput?fileName=/pdf/R-Chip/PYu-RC_Group_51_RoHS_L_4.pdf; ComponentLink1Description: http://www.yageo.com/NewPortal/yageodocoutput?fileName=/pdf/R-Chip/PYu-RC_Group_51_RoHS_L_4.pdf
R20 = Res1: Resistor; Manufacturer: Yageo; Manufacturer Part Number: RC0603JR-0782RL; Resistance (Ohms): 82; Tolerance: ±5%; Power (Watts): 0.1W, 1/10W; Temperature Coefficient: ±100ppm/°C; Supplier 1: Digi-Key; Supplier Part Number 1: 311-82GRCT-ND; RoHS: RoHS Compliant; Category: Resistors; Stock 1: 72049; Pricing 1: 1=0.16, 10=0.016, 25=0.0112, 50=0.0084, 100=0.0062, 250=0.0048, 500=0.00382, 1000=0.00281 (CAD); Packaging: Cut Tape (CT); Part Status: Active; Composition: Thick Film; Features: Moisture Resistant; Operating Temperature: -55°C ~ 155°C; Package / Case: 0603 (1608 Metric); Supplier Device Package: 0603; Size / Dimension: 0.063" L x 0.031" W (1.60mm x 0.80mm); Height - Seated (Max): 0.022" (0.55mm); Number of Terminations: 2; Failure Rate: -; ComponentLink1URL: http://www.yageo.com/NewPortal/yageodocoutput?fileName=/pdf/R-Chip/PYu-RC_Group_51_RoHS_L_4.pdf; ComponentLink1Description: http://www.yageo.com/NewPortal/yageodocoutput?fileName=/pdf/R-Chip/PYu-RC_Group_51_RoHS_L_4.pdf
Ref1 = LT6654AHS6-3.3: TSOT-23-56; Manufacturer: Linear Technology; Reference Type: Series; Output Type: Fixed; Voltage - Output (Min/Fixed): 3.3V; Current - Output: 10mA; Tolerance: ±0.05%; Temperature Coefficient: 10ppm/°C; Noise - 0.1Hz to 10Hz: 1.7ppmp-p; Noise - 10Hz to 10kHz: 2ppmrms; Voltage - Input: 3.8 V ~ 36 V; Current - Supply: 600µA; Manufacturer Part Number: LT6654AHS6-3.3; Digikey Part Number: LT6654AHS6-3.3#TRMPBFCT-ND; Digikey Link: http://www.digikey.com/product-detail/en/linear-technology/LT6654AHS6-3.3-TRMPBF/LT6654AHS6-3.3-TRMPBFCT-ND/2485839; Supplier 1: Digi-Key; Supplier Part Number 1: LT6654AHS6-3.3#TRMPBFCT-ND; RoHS: RoHS Compliant; Category: Integrated Circuits (ICs); Stock 1: 1315; Pricing 1: 1=9.53, 25=8.508, 100=5.5596, 250=5.1048 (CAD); Packaging: Cut Tape (CT); Part Status: Active; Voltage - Output (Max): -; Current - Cathode: -; Operating Temperature: -40°C ~ 125°C (TA); Mounting Type: Surface Mount; Package / Case: SOT-23-6 Thin, TSOT-23-6; Supplier Device Package: TSOT-23-6; ComponentLink1URL: http://www.linear.com/docs/29677; ComponentLink1Description: http://www.linear.com/docs/29677
U2 = CMP-2000-07460-1: Single Output Encapsulated Type, 12 V, 1.8 A, 21.6 W, -40 to 85 degC, 4-Pin THD, RoHS; Manufacturer: Mean Well; Output Current: 1.8A; Output Power: 21.6W; Voltage - Output 1: 12V; Efficiency: 84%; Approvals: CB; Number of Outputs: 1; Length: 53mm; RoHSCompliant: true; Lead Free: LeadFree; Packaging: Bulk; Package Description: 4-Pin Through Hole Device, Body 52.4 x 27.2 mm, Height 24 mm; Number of Pins: 4; Mount: ThroughHole; Min Operating Temperature: -30degC; Manufacturer URL: http://www.meanwellusa.com/; Weight: 2.081164oz; Package Quantity: 240; Package Reference: IRM-20-12-4; Datasheet URL: http://datasheet.octopart.com/IRM-20-12-Mean-Well-datasheet-42021592.pdf; Max Output Power: 21.6W; Max Operating Temperature: 70degC; Height: 24mm; Mounting Technology: ThroughHole; Datasheet Version: 06/2015; Current - Output 1: 1.8A; Width: 28mm; Supplier 1: Digi-Key; Supplier Part Number 1: 1866-3038-ND
U3 U4 = Volt Reg: Voltage Regulator; Published: 24-Mar-1999; LatestRevisionDate: 29-May-2009; LatestRevisionNote: IPC-7351 Footprint Added.; PackageReference: D2PAK; Publisher: Altium Limited; PackageDescription: 3-Pin Transistor Outline Package 2.54 mm Pitch, 15.1 mm Lead Span; Supplier 1: Digi-Key

## Sheet 5-Latching Delay.SchDoc
size A
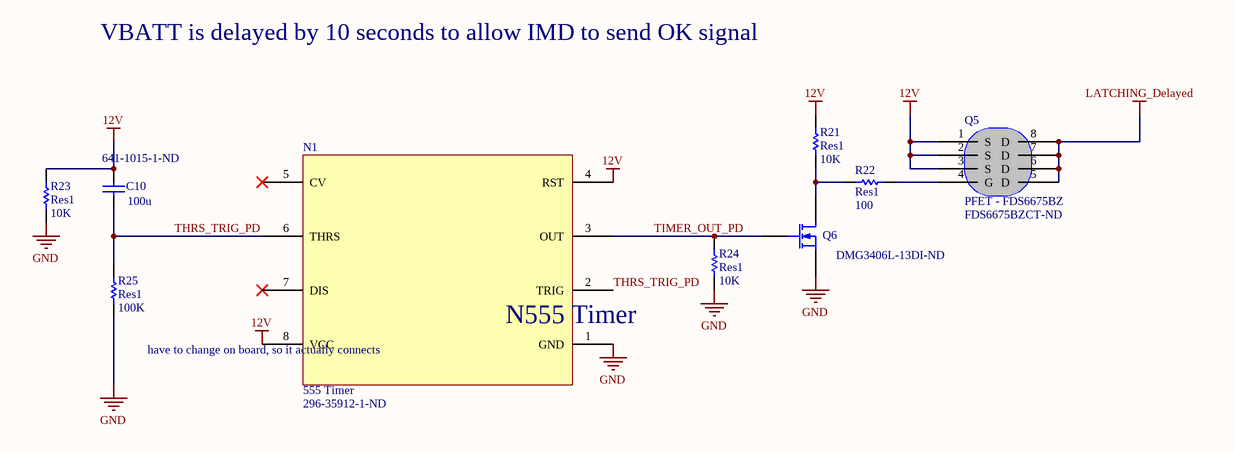
[diagram p4: 5-Latching Delay.SchDoc]

### Parts
C10  100u  Supplier Part Number 1: 641-1015-1-ND  [C1210]
N1  555 Timer  Supplier Part Number 1: 296-35912-1-ND  [SO8_M]
Q5  PFET - FDS6675BZ  Supplier Part Number 1: FDS6675BZCT-ND  [SOIC127P600X175-8N]
Q6  Supplier Part Number 1: DMG3406L-13DI-ND  [SOT-23_N]
R21  Res1  value 10K  [1608[0603]]
R22  Res1  value 100  [1608[0603]]
R23  Res1  value 10K  [1608[0603]]
R24  Res1  value 10K  [1608[0603]]
R25  Res1  value 100K  [1608[0603]]

### Nets
12V: C10.1 N1.4(RST) N1.8(VCC) Q5.1(S) Q5.2(S) Q5.3(S) R21.2 R23.2
GND: N1.1(GND) Q6.2(S) R23.1 R24.1 R25.1
LATCHING_Delayed: Q5.5(D) Q5.6(D) Q5.7(D) Q5.8(D)
THRS_TRIG_PD: C10.2 N1.2(TRIG) N1.6(THRS) R25.2
TIMER_OUT_PD: N1.3(OUT) Q6.1(G) R24.2
NetQ5_4: Q5.4(G) R22.2
NetQ6_3: Q6.3(D) R21.1 R22.1

Not connected (* = marked no-connect by the designer): N1 5(CV)* 7(DIS)*

### Notes on the sheet
- VBATT is delayed by 10 seconds to allow IMD to send OK signal
- (near N1) have to change on board, so it actually connects
- (in symbol 555 Timer) N555 Timer

### Library data of the parts
C10 = Cap: CAP CER 100UF 6.3V X5R 1206; Manufacturer: Murata Electronics North America; Manufacturer Part Number: GRM31CR60J107ME39K; Capacitance: 100µF; Tolerance: ±20%; RoHS: RoHS Compliant; Category: Capacitors; Packaging: Cut Tape (CT); Part Status: Active; Voltage - Rated: 6.3V; Temperature Coefficient: X5R; Operating Temperature: -55°C ~ 85°C; Features: -; Ratings: -; Applications: General Purpose; Mounting Type: Surface Mount, MLCC; Package / Case: 1206 (3216 Metric); Size / Dimension: 0.126" L x 0.063" W (3.20mm x 1.60mm); Height - Seated (Max): -; Thickness (Max): 0.071" (1.80mm); Lead Spacing: -; Lead Style: -; ComponentLink1URL: http://www.murata.com/~/media/webrenewal/support/library/catalog/products/capacitor/mlcc/c02e.ashx; ComponentLink1Description: http://www.murata.com/~/media/webrenewal/support/library/catalog/products/capacitor/mlcc/c02e.ashx; Supplier 1: Digi-Key
N1 = 555 Timer: IC OSC SGL TIMER 100KHZ 8-SOIC; Manufacturer: Texas Instruments; Manufacturer Part Number: NE555DRG4; Voltage - Supply: 4.5 V ~ 16 V; Current - Supply: 10mA; Supplier 1: Digi-Key; RoHS: RoHS Compliant; Category: Integrated Circuits (ICs); Stock 1: 6208; Pricing 1: 1=0.71, 10=0.532, 100=0.3314, 500=0.22672, 1000=0.17441 (CAD); Packaging: Cut Tape (CT); Part Status: Active; Type: 555 Type, Timer/Oscillator (Single); Count: -; Frequency: 100kHz; Operating Temperature: 0°C ~ 70°C; Package / Case: 8-SOIC (0.154", 3.90mm Width); Supplier Device Package: 8-SOIC; Mounting Type: Surface Mount; ComponentLink1URL: http://www.ti.com/lit/ds/symlink/ne555.pdf; ComponentLink1Description: http://www.ti.com/lit/ds/symlink/ne555.pdf
Q5 = MOSFET: as Q1 on sheet 2-FET Control; Supplier 1: Digi-Key; Manufacturer Part Number: FDS6675BZ; RoHS: RoHS Compliant; Category: Discrete Semiconductor Products; Stock 1: 7940; Pricing 1: 1=1.29, 10=1.156, 100=0.9013, 500=0.74452, 1000=0.58778 (CAD); Packaging: Cut Tape (CT); Part Status: Active; Technology: MOSFET (Metal Oxide); FET Feature: -; Operating Temperature: -55°C ~ 150°C (TJ); Mounting Type: Surface Mount; Supplier Device Package: 8-SO; Package / Case: 8-SOIC (0.154", 3.90mm Width); ComponentLink1URL: https://www.fairchildsemi.com/datasheets/FD/FDS6675BZ.pdf; ComponentLink1Description: https://www.fairchildsemi.com/datasheets/FD/FDS6675BZ.pdf
Q6 = MOSFET-N: as Q2 on sheet 2-FET Control; Published: 8-Jun-2000; LatestRevisionDate: 17-Jul-2002; LatestRevisionNote: Re-released for DXP Platform.; PackageVersion: 1995/1996; PackageReference: E3; Publisher: Altium Limited; PackageDescription: TO, Flat Index; 3 In-Line, Axial Leads; Body Dia. 4.6mm; Lead Dia. 0.5 mm (max); RoHS: RoHS Compliant; Category: Discrete Semiconductor Products; Packaging: Cut Tape (CT); Mounting Type: Surface Mount; Package / Case: TO-252-3, DPak (2 Leads + Tab), SC-63; Supplier Device Package: PG-TO252-3; ComponentLink1URL: http://www.infineon.com/dgdl/Infineon-IPD075N03LG-DS-v02_01-en.pdf?folderId=5546d4694909da4801490a07012f053b&fileId=db3a30431936bc4b011951d824f83aeb; ComponentLink1Description: http://www.infineon.com/dgdl/Infineon-IPD075N03LG-DS-v02_01-en.pdf?folderId=5546d4694909da4801490a07012f053b&fileId=db3a30431936bc4b011951d824f83aeb; ComponentLink2URL: http://www.semicon.toshiba.co.jp/info/docget.jsp?type=datasheet&lang=en&pid=SSM3K329R; ComponentLink2Description: http://www.semicon.toshiba.co.jp/info/docget.jsp?type=datasheet&lang=en&pid=SSM3K329R; Supplier 1: Digi-Key
R21 R23 R24 = Res1: as R8 on sheet 2-FET Control; Published: 8-Jun-2000; LatestRevisionDate: 17-Jul-2002; LatestRevisionNote: Re-released for DXP Platform.; PackageReference: AXIAL-0.3; Publisher: Altium Limited; PackageDescription: Axial Device, Thru-Hole; 2 Leads; 0.3 in Pin Spacing; Supplier 1: Digi-Key; Supplier Part Number 1: RHM10KDCT-ND; RoHS: RoHS Compliant; Category: Resistors; Stock 1: 0; Pricing 1: 1=0.15, 10=0.119, 25=0.0824, 50=0.0642, 100=0.0458, 250=0.03568, 500=0.02836, 1000=0.02012 (CAD); Packaging: Cut Tape (CT); Part Status: Active; Resistance (Ohms): 10k; Tolerance: ±5%; Composition: Thick Film; Features: Automotive AEC-Q200, Pulse Withstanding; Operating Temperature: -55°C ~ 155°C; Package / Case: 0603 (1608 Metric); Supplier Device Package: 0603; Size / Dimension: 0.063" L x 0.031" W (1.60mm x 0.80mm); Height - Seated (Max): 0.022" (0.55mm); Failure Rate: -; ComponentLink1URL: http://rohmfs.rohm.com/en/products/databook/datasheet/passive/resistor/chip_resistor/esr.pdf; ComponentLink1Description: http://rohmfs.rohm.com/en/products/databook/datasheet/passive/resistor/chip_resistor/esr.pdf
R22 = Res1: RES SMD 100 OHM 5% 1/4W 0603; Manufacturer: Rohm Semiconductor; Manufacturer Part Number: ESR03EZPJ101; Power (Watts): 0.25W, 1/4W; Temperature Coefficient: ±200ppm/°C; Published: 8-Jun-2000; LatestRevisionDate: 17-Jul-2002; LatestRevisionNote: Re-released for DXP Platform.; PackageReference: AXIAL-0.3; Publisher: Altium Limited; PackageDescription: Axial Device, Thru-Hole; 2 Leads; 0.3 in Pin Spacing; Supplier 1: Digi-Key; Supplier Part Number 1: RHM100DCT-ND; RoHS: RoHS Compliant; Category: Resistors; Stock 1: 57430; Pricing 1: 1=0.15, 10=0.119, 25=0.0824, 50=0.0642, 100=0.0458, 250=0.03568, 500=0.02836, 1000=0.02012 (CAD); Packaging: Cut Tape (CT); Part Status: Active; Resistance (Ohms): 100; Tolerance: ±5%; Composition: Thick Film; Features: Automotive AEC-Q200, Pulse Withstanding; Operating Temperature: -55°C ~ 155°C; Package / Case: 0603 (1608 Metric); Supplier Device Package: 0603; Size / Dimension: 0.063" L x 0.031" W (1.60mm x 0.80mm); Height - Seated (Max): 0.022" (0.55mm); Failure Rate: -; ComponentLink1URL: http://rohmfs.rohm.com/en/products/databook/datasheet/passive/resistor/chip_resistor/esr.pdf; ComponentLink1Description: http://rohmfs.rohm.com/en/products/databook/datasheet/passive/resistor/chip_resistor/esr.pdf
R25 = Res1: RES SMD 33K OHM 5% 1/4W 0603; Manufacturer: Rohm Semiconductor; Manufacturer Part Number: ESR03EZPJ333; Power (Watts): 0.25W, 1/4W; Temperature Coefficient: ±200ppm/°C; Published: 8-Jun-2000; LatestRevisionDate: 17-Jul-2002; LatestRevisionNote: Re-released for DXP Platform.; PackageReference: AXIAL-0.3; Publisher: Altium Limited; PackageDescription: Axial Device, Thru-Hole; 2 Leads; 0.3 in Pin Spacing; Supplier 1: Digi-Key; Supplier Part Number 1: RHM33KDCT-ND; RoHS: RoHS Compliant; Category: Resistors; Stock 1: 5269; Pricing 1: 1=0.15, 10=0.119, 25=0.0824, 50=0.0642, 100=0.0458, 250=0.03568, 500=0.02836, 1000=0.02012 (CAD); Packaging: Cut Tape (CT); Part Status: Active; Resistance (Ohms): 33k; Tolerance: ±5%; Composition: Thick Film; Features: Automotive AEC-Q200, Pulse Withstanding; Operating Temperature: -55°C ~ 155°C; Package / Case: 0603 (1608 Metric); Supplier Device Package: 0603; Size / Dimension: 0.063" L x 0.031" W (1.60mm x 0.80mm); Height - Seated (Max): 0.022" (0.55mm); Failure Rate: -; ComponentLink1URL: http://rohmfs.rohm.com/en/products/databook/datasheet/passive/resistor/chip_resistor/esr.pdf; ComponentLink1Description: http://rohmfs.rohm.com/en/products/databook/datasheet/passive/resistor/chip_resistor/esr.pdf

## Sheet 6-Latching AMS.SchDoc
size A
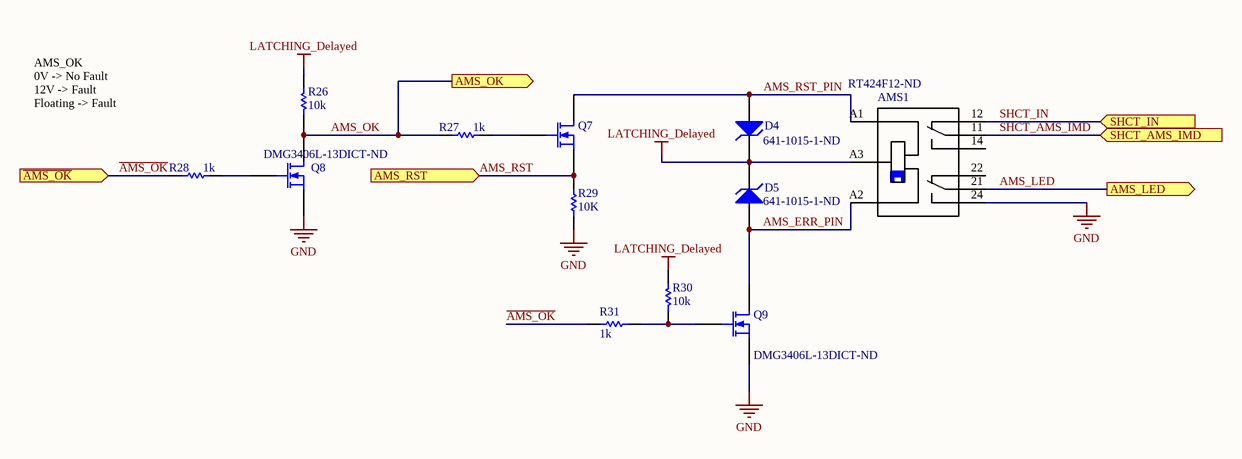
[diagram p5: 6-Latching AMS.SchDoc]

### Parts
AMS1  Supplier Part Number 1: RT424F12-ND  [TE_5-1393243-4]  (hidden comment: 5-1393243-4)
D4  Supplier Part Number 1: 641-1015-1-ND  [DO214AC]  (hidden comment: D Zener)
D5  Supplier Part Number 1: 641-1015-1-ND  [DO214AC]  (hidden comment: D Zener)
Q7  (no value)  [SOT-23_N]
Q8  Supplier Part Number 1: DMG3406L-13DICT-ND  [SOT-23_N]
Q9  Supplier Part Number 1: DMG3406L-13DICT-ND  [SOT-23_N]
R26  Resistance (Ohms): 10k  [1608[0603]]  (hidden comment: RHM1.0KDCT-ND)
R27  value 1k  [1608[0603]]  (hidden comment: Res1)
R28  value 1k  [1608[0603]]  (hidden comment: Res1)
R29  value 10K  [1608[0603]]  (hidden comment: Res1)
R30  Resistance (Ohms): 10k  [1608[0603]]  (hidden comment: RHM1.0KDCT-ND)
R31  1k  [1608[0603]]

### Ports
AMS_LED (out), AMS_OK (out), AMS_RST (in), SHCT_AMS_IMD (in), SHCT_IN (in), ~{AMS_OK} (in)

### Nets
GND: AMS1.24 Q8.2(S) Q9.2(S) R29.1
LATCHING_Delayed: AMS1.A3 D4.2(K) D5.2(K) R26.1 R30.1
~{AMS_OK}: R28.1 R31.1 ; port ~{AMS_OK}
AMS_ERR_PIN: AMS1.A2 D5.1(A) Q9.3(D)
AMS_LED: AMS1.21 ; port AMS_LED
AMS_OK: Q8.3(D) R26.2 R27.1 ; port AMS_OK
AMS_RST: Q7.2(S) R29.2 ; port AMS_RST
AMS_RST_PIN: AMS1.A1 D4.1(A) Q7.3(D)
SHCT_AMS_IMD: AMS1.11 ; port SHCT_AMS_IMD
SHCT_IN: AMS1.12 ; port SHCT_IN
NetQ7_1: Q7.1(G) R27.2
NetQ8_1: Q8.1(G) R28.2
NetQ9_1: Q9.1(G) R30.2 R31.2

Not connected (* = marked no-connect by the designer): AMS1 14 22

### Notes on the sheet
- AMS_OK
  0V -> No Fault
  12V -> Fault
  Floating -> Fault

### Library data of the parts
AMS1 = 5-1393243-4: Electromechanical Relay 12VDC 240Ohm 15A DPDT __ 29mm 12.7mm 15.7mm__ THT Power Relay; MF: TE Connectivity; TE_purchase_URL: https://www.te.com/usa-en/product-5-1393243-4.html?te_bu=Cor&te_type=disp&te_campaign=seda_glo_cor-seda-global-disp-prtnr-fy19-seda-model-bom-cta_sma-317_1&elqCampaignId=32493; Package: None; MP: 5-1393243-4; Digi-Key_Purchase_URL: *; Digi-Key_Part_Number: *; SnapEDA_Link: https://www.snapeda.com/parts/5-1393243-4/TE%20Connectivity/view-part/?ref=snap; Value: *; Supplier 1: Digi-Key
D4 D5 = D Zener: Zener Diode; Published: 8-Jun-2000; LatestRevisionDate: 17-Jul-2002; LatestRevisionNote: Re-released for DXP Platform.; PackageReference: DIODE-0.7; Publisher: Altium Limited; PackageDescription: Diode, Thru-Hole; 2 Leads; 0.7 in Pin Spacing; Supplier 1: Digi-Key
Q7-Q9 = MOSFET-N: N-Channel MOSFET; Manufacturer: Infineon Technologies; FET Type: MOSFET N-Channel, Metal Oxide; FET Feature: Logic Level Gate; Drain to Source Voltage (Vdss): 30V; Current - Continuous Drain (Id) @ 25°C: 50A (Tc); Rds On (Max) @ Id, Vgs: 7.5 mOhm @ 30A, 10V; Vgs(th) (Max) @ Id: 2.2V @ 250µA; Gate Charge (Qg) @ Vgs: 18nC @ 10V; Input Capacitance (Ciss) @ Vds: 1900pF @ 15V; Power - Max: 47W; Published: 8-Jun-2000; LatestRevisionDate: 17-Jul-2002; LatestRevisionNote: Re-released for DXP Platform.; PackageVersion: 1995/1996; PackageReference: E3; Publisher: Altium Limited; PackageDescription: TO, Flat Index; 3 In-Line, Axial Leads; Body Dia. 4.6mm; Lead Dia. 0.5 mm (max); RoHS: RoHS Compliant; Category: Discrete Semiconductor Products; Packaging: Cut Tape (CT); Mounting Type: Surface Mount; Package / Case: TO-252-3, DPak (2 Leads + Tab), SC-63; Supplier Device Package: PG-TO252-3; ComponentLink1URL: http://www.infineon.com/dgdl/Infineon-IPD075N03LG-DS-v02_01-en.pdf?folderId=5546d4694909da4801490a07012f053b&fileId=db3a30431936bc4b011951d824f83aeb; ComponentLink1Description: http://www.infineon.com/dgdl/Infineon-IPD075N03LG-DS-v02_01-en.pdf?folderId=5546d4694909da4801490a07012f053b&fileId=db3a30431936bc4b011951d824f83aeb; ComponentLink2URL: http://www.semicon.toshiba.co.jp/info/docget.jsp?type=datasheet&lang=en&pid=SSM3K329R; ComponentLink2Description: http://www.semicon.toshiba.co.jp/info/docget.jsp?type=datasheet&lang=en&pid=SSM3K329R; Supplier 1: Digi-Key
  Q7: Supplier Part Number 1: DMG3406L-13DICT-ND
R26 R30 = Res1: RES SMD 1.0K OHM 5% 1/4W 0603; Manufacturer: Rohm Semiconductor; Manufacturer Part Number: ESR03EZPJ102; Power (Watts): 0.25W, 1/4W; Temperature Coefficient: ±200ppm/°C; Supplier 1: Digi-Key; Supplier Part Number 1: RHM1.0KDCT-ND; RoHS: RoHS Compliant; Category: Resistors; Stock 1: 220; Pricing 1: 1=0.15, 10=0.119, 25=0.0824, 50=0.0642, 100=0.0458, 250=0.03568, 500=0.02836, 1000=0.02012 (CAD); Packaging: Cut Tape (CT); Part Status: Active; Tolerance: ±5%; Composition: Thick Film; Features: Automotive AEC-Q200, Pulse Withstanding; Operating Temperature: -55°C ~ 155°C; Package / Case: 0603 (1608 Metric); Supplier Device Package: 0603; Size / Dimension: 0.063" L x 0.031" W (1.60mm x 0.80mm); Height - Seated (Max): 0.022" (0.55mm); Failure Rate: -; ComponentLink1URL: http://rohmfs.rohm.com/en/products/databook/datasheet/passive/resistor/chip_resistor/esr.pdf; ComponentLink1Description: http://rohmfs.rohm.com/en/products/databook/datasheet/passive/resistor/chip_resistor/esr.pdf
R27 R28 = Res1: RES SMD 100 OHM 5% 1/4W 0603; Manufacturer: Rohm Semiconductor; Manufacturer Part Number: ESR03EZPJ101; Resistance (Ohms): 100; Power (Watts): 0.25W, 1/4W; Temperature Coefficient: ±200ppm/°C; Published: 8-Jun-2000; LatestRevisionDate: 17-Jul-2002; LatestRevisionNote: Re-released for DXP Platform.; PackageReference: AXIAL-0.3; Publisher: Altium Limited; PackageDescription: Axial Device, Thru-Hole; 2 Leads; 0.3 in Pin Spacing; Supplier 1: Digi-Key; Supplier Part Number 1: RHM100DCT-ND; RoHS: RoHS Compliant; Category: Resistors; Stock 1: 57430; Pricing 1: 1=0.15, 10=0.119, 25=0.0824, 50=0.0642, 100=0.0458, 250=0.03568, 500=0.02836, 1000=0.02012 (CAD); Packaging: Cut Tape (CT); Part Status: Active; Tolerance: ±5%; Composition: Thick Film; Features: Automotive AEC-Q200, Pulse Withstanding; Operating Temperature: -55°C ~ 155°C; Package / Case: 0603 (1608 Metric); Supplier Device Package: 0603; Size / Dimension: 0.063" L x 0.031" W (1.60mm x 0.80mm); Height - Seated (Max): 0.022" (0.55mm); Failure Rate: -; ComponentLink1URL: http://rohmfs.rohm.com/en/products/databook/datasheet/passive/resistor/chip_resistor/esr.pdf; ComponentLink1Description: http://rohmfs.rohm.com/en/products/databook/datasheet/passive/resistor/chip_resistor/esr.pdf
R29 = Res1: as R8 on sheet 2-FET Control; Published: 8-Jun-2000; LatestRevisionDate: 17-Jul-2002; LatestRevisionNote: Re-released for DXP Platform.; PackageReference: AXIAL-0.3; Publisher: Altium Limited; PackageDescription: Axial Device, Thru-Hole; 2 Leads; 0.3 in Pin Spacing; Supplier 1: Digi-Key; Supplier Part Number 1: RHM10KDCT-ND; RoHS: RoHS Compliant; Category: Resistors; Stock 1: 0; Pricing 1: 1=0.15, 10=0.119, 25=0.0824, 50=0.0642, 100=0.0458, 250=0.03568, 500=0.02836, 1000=0.02012 (CAD); Packaging: Cut Tape (CT); Resistance (Ohms): 10k; Tolerance: ±5%; Composition: Thick Film; Features: Automotive AEC-Q200, Pulse Withstanding; Operating Temperature: -55°C ~ 155°C; Package / Case: 0603 (1608 Metric); Supplier Device Package: 0603 (1608 Metric); Size / Dimension: 0.063" L x 0.031" W (1.60mm x 0.80mm); Height: 0.022" (0.55mm); Number of Terminations: 2; ComponentLink1URL: http://rohmfs.rohm.com/en/products/databook/datasheet/passive/resistor/chip_resistor/esr.pdf; ComponentLink1Description: http://rohmfs.rohm.com/en/products/databook/datasheet/passive/resistor/chip_resistor/esr.pdf; Supplier 2: Digi-Key; Supplier Part Number 2: 311-10KGRCT-ND; Part Status: Active; Height - Seated (Max): 0.022" (0.55mm); Failure Rate: -
R31 = Res1: Resistor; Manufacturer: Panasonic Electronic Components; Manufacturer Part Number: ERJ-3EKF60R4V; Value: 120; Resistance (Ohms): 60.4; Tolerance: ±1%; Power (Watts): 0.1W, 1/10W; Temperature Coefficient: ±100ppm/°C; Published: 8-Jun-2000; LatestRevisionDate: 17-Jul-2002; LatestRevisionNote: Re-released for DXP Platform.; PackageReference: AXIAL-0.3; Publisher: Altium Limited; PackageDescription: Axial Device, Thru-Hole; 2 Leads; 0.3 in Pin Spacing; Supplier 1: Digi-Key; Supplier Part Number 1: P60.4HCT-ND; RoHS: RoHS Compliant; Category: Resistors; Stock 1: 113077; Pricing 1: 1=0.15, 50=0.0176, 100=0.0129, 250=0.00992, 500=0.0079, 1000=0.00583 (CAD); Packaging: Cut Tape (CT); Composition: Thick Film; Features: Automotive AEC-Q200; Operating Temperature: -55°C ~ 155°C; Package / Case: 0603 (1608 Metric); Supplier Device Package: 0603; Size / Dimension: 0.063" L x 0.031" W (1.60mm x 0.80mm); Height: 0.022" (0.55mm); Number of Terminations: 2; ComponentLink1URL: http://industrial.panasonic.com/www-cgi/jvcr13pz.cgi?E+PZ+3+AOA0002+ERJ3EKF60R4V+7+WW; ComponentLink1Description: http://industrial.panasonic.com/www-cgi/jvcr13pz.cgi?E+PZ+3+AOA0002+ERJ3EKF60R4V+7+WW